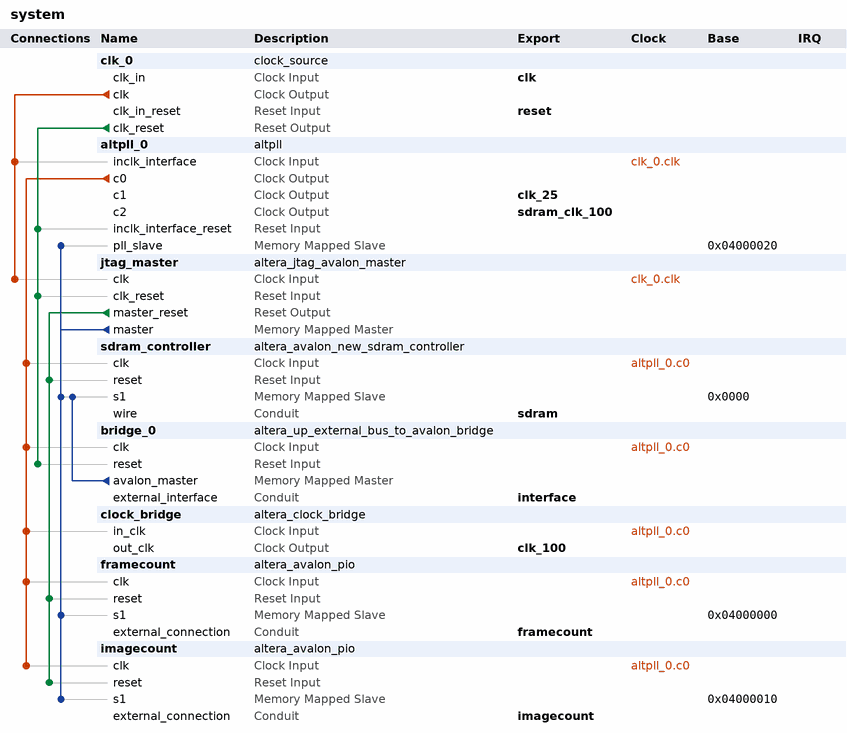
[diagram p0: system contents]
# Platform Designer (Qsys) system system, MAX 10 10M50DAF484C7G
# Parameters at their usual value, and those the tool derives, are not listed.
package require -exact qsys 18.0
create_system system
set_project_property DEVICE_FAMILY {MAX 10}
set_project_property DEVICE 10M50DAF484C7G

add_instance clk_0 clock_source 18.0
set_instance_parameter_value clk_0 clockFrequency 50000000

add_instance altpll_0 altpll 18.0
set_instance_parameter_value altpll_0 CLK0_DIVIDE_BY 1
set_instance_parameter_value altpll_0 CLK0_MULTIPLY_BY 2
set_instance_parameter_value altpll_0 CLK1_DIVIDE_BY 2
set_instance_parameter_value altpll_0 CLK1_DUTY_CYCLE 50
set_instance_parameter_value altpll_0 CLK1_MULTIPLY_BY 1
set_instance_parameter_value altpll_0 CLK1_PHASE_SHIFT 0
set_instance_parameter_value altpll_0 CLK2_DIVIDE_BY 1
set_instance_parameter_value altpll_0 CLK2_DUTY_CYCLE 50
set_instance_parameter_value altpll_0 CLK2_MULTIPLY_BY 2
set_instance_parameter_value altpll_0 CLK2_PHASE_SHIFT -3000
set_instance_parameter_value altpll_0 INCLK0_INPUT_FREQUENCY 20000
set_instance_parameter_value altpll_0 PORT_ARESET PORT_UNUSED
set_instance_parameter_value altpll_0 PORT_LOCKED PORT_UNUSED
set_instance_parameter_value altpll_0 PORT_clk1 PORT_USED
set_instance_parameter_value altpll_0 PORT_clk2 PORT_USED
set_instance_parameter_value altpll_0 PORT_clk3 PORT_UNUSED

add_instance jtag_master altera_jtag_avalon_master 18.0
set_instance_parameter_value jtag_master USE_PLI 1

add_instance sdram_controller altera_avalon_new_sdram_controller 18.0
set_instance_parameter_value sdram_controller TAC 6.0
set_instance_parameter_value sdram_controller TRCD 15.0
set_instance_parameter_value sdram_controller TRFC 55.0
set_instance_parameter_value sdram_controller TRP 15.0
set_instance_parameter_value sdram_controller TWR 15.0
set_instance_parameter_value sdram_controller casLatency 2
set_instance_parameter_value sdram_controller columnWidth 10
set_instance_parameter_value sdram_controller dataWidth 16
set_instance_parameter_value sdram_controller generateSimulationModel true
set_instance_parameter_value sdram_controller initRefreshCommands 8
set_instance_parameter_value sdram_controller model single_Micron_MT48LC4M32B2_7_chip
set_instance_parameter_value sdram_controller numberOfBanks 4
set_instance_parameter_value sdram_controller numberOfChipSelects 1
set_instance_parameter_value sdram_controller powerUpDelay 100.0
set_instance_parameter_value sdram_controller refreshPeriod 7.8125
set_instance_parameter_value sdram_controller rowWidth 13

add_instance bridge_0 altera_up_external_bus_to_avalon_bridge 18.0
set_instance_parameter_value bridge_0 addr_size 64
set_instance_parameter_value bridge_0 addr_size_multiplier Mbytes
set_instance_parameter_value bridge_0 data_size 128

add_instance clock_bridge altera_clock_bridge 18.0
set_instance_parameter_value clock_bridge DERIVED_CLOCK_RATE 100000000
set_instance_parameter_value clock_bridge EXPLICIT_CLOCK_RATE 0

add_instance framecount altera_avalon_pio 18.0
set_instance_parameter_value framecount direction Output
set_instance_parameter_value framecount width 8

add_instance imagecount altera_avalon_pio 18.0
set_instance_parameter_value imagecount direction Output
set_instance_parameter_value imagecount width 8

# connections
add_connection altpll_0.c0 bridge_0.clk clock
add_connection altpll_0.c0 clock_bridge.in_clk clock
add_connection altpll_0.c0 framecount.clk clock
add_connection altpll_0.c0 imagecount.clk clock
add_connection altpll_0.c0 sdram_controller.clk clock
add_connection clk_0.clk altpll_0.inclk_interface clock
add_connection clk_0.clk jtag_master.clk clock
add_connection clk_0.clk_reset altpll_0.inclk_interface_reset reset
add_connection clk_0.clk_reset bridge_0.reset reset
add_connection clk_0.clk_reset jtag_master.clk_reset reset
add_connection jtag_master.master_reset framecount.reset reset
add_connection jtag_master.master_reset imagecount.reset reset
add_connection jtag_master.master_reset sdram_controller.reset reset
add_connection bridge_0.avalon_master sdram_controller.s1 avalon
set_connection_parameter_value bridge_0.avalon_master/sdram_controller.s1 baseAddress 0x0000
add_connection jtag_master.master altpll_0.pll_slave avalon
set_connection_parameter_value jtag_master.master/altpll_0.pll_slave baseAddress 0x04000020
add_connection jtag_master.master framecount.s1 avalon
set_connection_parameter_value jtag_master.master/framecount.s1 baseAddress 0x04000000
add_connection jtag_master.master imagecount.s1 avalon
set_connection_parameter_value jtag_master.master/imagecount.s1 baseAddress 0x04000010
add_connection jtag_master.master sdram_controller.s1 avalon
set_connection_parameter_value jtag_master.master/sdram_controller.s1 baseAddress 0x0000

# exported interfaces
add_interface clk clock sink
set_interface_property clk EXPORT_OF clk_0.clk_in
add_interface clk_100 clock source
set_interface_property clk_100 EXPORT_OF clock_bridge.out_clk
add_interface clk_25 clock source
set_interface_property clk_25 EXPORT_OF altpll_0.c1
add_interface framecount conduit end
set_interface_property framecount EXPORT_OF framecount.external_connection
add_interface imagecount conduit end
set_interface_property imagecount EXPORT_OF imagecount.external_connection
add_interface interface conduit end
set_interface_property interface EXPORT_OF bridge_0.external_interface
add_interface reset reset sink
set_interface_property reset EXPORT_OF clk_0.clk_in_reset
add_interface sdram conduit end
set_interface_property sdram EXPORT_OF sdram_controller.wire
add_interface sdram_clk_100 clock source
set_interface_property sdram_clk_100 EXPORT_OF altpll_0.c2

set_interconnect_requirement {$system} qsys_mm.clockCrossingAdapter HANDSHAKE
set_interconnect_requirement {$system} qsys_mm.enableEccProtection FALSE
set_interconnect_requirement {$system} qsys_mm.insertDefaultSlave FALSE
set_interconnect_requirement {$system} qsys_mm.maxAdditionalLatency 1

save_system system.qsys
